# EAGLE design Fuel Sensor (EAGLE 7.5.0)
CNAME: MySensors Fuel Gauge; CREVISION: 1.0; DESIGNER: Diving91
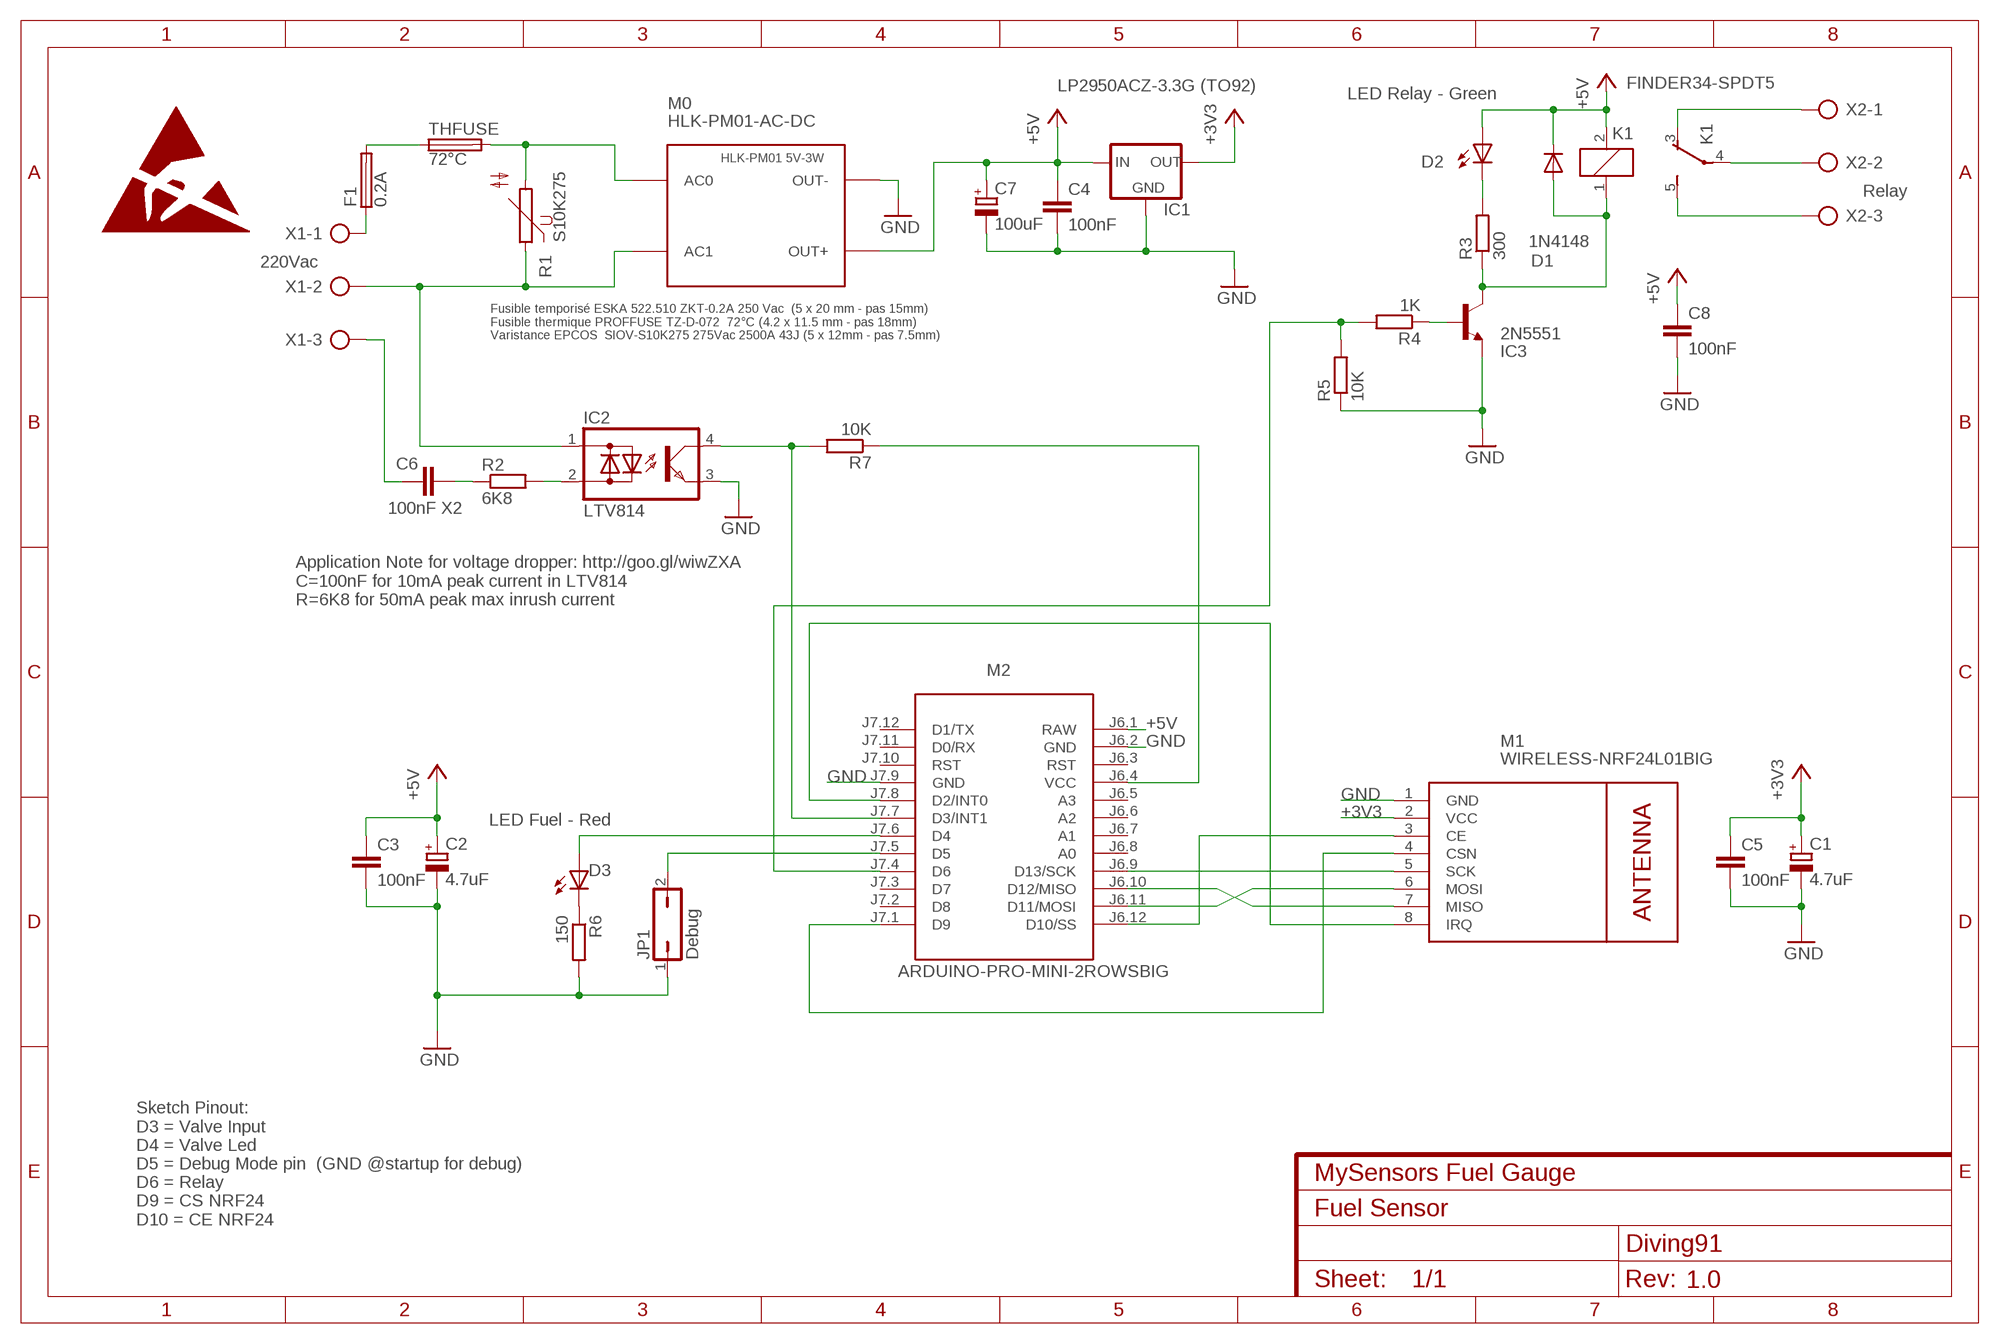
[diagram p0: schematic, sheet 1]

## Parts
C1  4.7uF  CPOL-RADE2-5  [E2-5]
C2  4.7uF  CPOL-RADE2-5  [E2-5]
C3  100nF  CNP-RADC320  [C-C320]
C4  100nF  CNP-RADC320  [C-C320]
C5  100nF  CNP-RADC320  [C-C320]
C6  100nF X2  CNP-RADB32922  [C-B32922-MKPX2]
C7  100uF  CPOL-RADE3-8  [E3-8]
C8  100nF  CNP-RADC320  [C-C320]
D1  1N4148  1N4148DO35  [DO35]
D2  LED Relay - Green  LED5MM  [LED5MM]
D3  LED Fuel - Red  LED5MM  [LED5MM]
F1  0.2A  PTF75  [PTF75]
IC1  LP2950ACZ-3.3G (TO92)  78LXXTO92L  [DC-DC-TO92L]
IC2  LTV814  [DIL04]
IC3  2N5551  T-NPNT092L  [T-T092L]
JP1  Debug  JUMPER2  [JUMPER2]
K1  FINDER34-SPDT5  [FINDER34-SPDT]
M0  HLK-PM01-AC-DC  [HLK-PM01-AC-DC]
M1  WIRELESS-NRF24L01BIG  [WIRELESS-NRF24L01-DIY]
M2  ARDUINO-PRO-MINI-2ROWSBIG  [ARDUINO-PRO-MINI-2ROWS-DIY]
R1  S10K275  [S10K275]
R2  6K8  RPMR02S  [PMR02S]
R3  300  RPMR0.25W  [PMR0.25W]
R4  1K  RPMR0.25W  [PMR0.25W]
R5  10K  RPMR0.25W  [PMR0.25W]
R6  150  RPMR0.25W  [PMR0.25W]
R7  10K  RPMR0.25W  [PMR0.25W]
THFUSE  72°C  PROFFUSE-TZ-D  [PROFFUSE-TZ-D]
X1  220Vac  DG301-5.0-3  [DG301-5.0-3]
X2  Relay  DG301-5.0-3  [DG301-5.0-3]

## Nets
+3V3 [VCC]: C1.+ C5.1 IC1.OUT M1.2(VCC)
+5V [VCC]: C2.+ C3.1 C4.1 C7.+ C8.1 D1.C D2.A IC1.IN K1.2 M0.OUT+ M2.J6.1(RAW)
GND [VCC]: C1.- C2.- C3.2 C4.2 C5.2 C7.- C8.2 IC1.GND IC2.3(E) IC3.E JP1.1 M0.OUT- M1.1(GND) M2.J6.2(GND) M2.J7.9(GND) R5.1 R6.2
LINE [AC]: F1.1 X1.1
LINE1 [AC]: F1.2 THFUSE.1
N$1: D2.K(C) R3.2
N$2: M1.8(IRQ) M2.J7.8(D2/INT0)
N$3: D1.A IC3.C K1.1 R3.1
N$4 [AC]: M0.AC0 R1.2 THFUSE.2
N$5: M1.7(MISO) M2.J6.10(D12/MISO)
N$6: M1.6(MOSI) M2.J6.11(D11/MOSI)
N$7: M1.4(CSN) M2.J7.1(D9)
N$8: M1.5(SCK) M2.J6.9(D13/SCK)
N$9: M1.3(CE) M2.J6.12(D10/SS)
N$10: JP1.2 M2.J7.5(D5)
N$11: D3.A M2.J7.6(D4)
N$12: M2.J7.4(D6) R4.2 R5.2
N$13: IC2.4(C) M2.J7.7(D3/INT1) R7.2
N$14: M2.J6.4(VCC) R7.1
N$16: D3.K(C) R6.1
N$17 [AC]: C6.2 R2.1
N$18 [AC]: IC2.2(AC2) R2.2
N$20: IC3.B R4.1
NEUTRAL [AC]: IC2.1(AC1) M0.AC1 R1.1 X1.2
RC: K1.4(-1:P) X2.2
ROFF: K1.3(-1:O) X2.1
RON: K1.5(-1:S) X2.3
VALVE [AC]: C6.1 X1.3
Unconnected: M2.J6.3(RST) M2.J6.5(A3) M2.J6.6(A2) M2.J6.7(A1) M2.J6.8(A0) M2.J7.2(D8) M2.J7.3(D7) M2.J7.10(RST) M2.J7.11(D0/RX) M2.J7.12(D1/TX)

## Notes on the sheet
- Fusible temporisé ESKA 522.510 ZKT-0.2A 250 Vac  (5 x 20 mm - pas 15mm)
  Fusible thermique PROFFUSE TZ-D-072  72°C (4.2 x 11.5 mm - pas 18mm)
  Varistance EPCOS  SIOV-S10K275 275Vac 2500A 43J (5 x 12mm - pas 7.5mm)
- Application Note for voltage dropper: http://goo.gl/wiwZXA
  C=100nF for 10mA peak current in LTV814
  R=6K8 for 50mA peak max inrush current
- Sketch Pinout:
  D3 = Valve Input
  D4 = Valve Led
  D5 = Debug Mode pin  (GND @startup for debug)
  D6 = Relay
  D9 = CS NRF24
  D10 = CE NRF24

## Library data of the parts
C1 C2 C7 = diving91:CPOL-RAD: POLARIZED CAPACITOR, European symbol
C3-C6 C8 = diving91:CNP-RAD: CAPACITOR naming: grid - package width
D1 = diving91:1N4148: DIODE high speed (Philips)
D2 D3 = diving91:LED5MM
F1 = diving91:PTF75: FUSE HOLDER grid 15mm Stelvio Kontex PTF75
IC1 = diving91:78LXX: VOLTAGE REGULATOR
IC2 = diving91:LTV814: Liteon OPTO COUPLER
IC3 = diving91:T-NPN
JP1 = diving91:JUMPER2: JUMPER
K1 = diving91:FINDER34-SPDT: Finder Serie 34 SPDT Relai
M0 = diving91:HLK-PM01-AC-DC: HLK-PM01 AC-DC 110-220VAC to 5V Mini Power Supply Module http://www.hlktech.net/product_detail.php?ProId=54
M1 = diving91:WIRELESS-NRF24L01: 2.4 GHz Wireless Module based on NRF24L01 chip
M2 = diving91:ARDUINO-PRO-MINI-2ROWS: Arduino Pro Mini deek-Robot Only 2 main rows
R1 = diving91:S10K275: VARISTOR
R2-R7 = diving91:R: RESISTOR, European symbol
THFUSE = diving91:PROFFUSE-TZ-D: PROFFUSE TZ-D
X1 X2 = diving91:DG301-5.0-3: CONNECTOR Degson DG301 5.0mm

## Net classes
0 default: width 0.635 mm, clearance 0.635 mm
1 AC: width 1.778 mm, clearance 1.778 mm
2 VCC: width 1.27 mm, clearance 0.762 mm

## Board
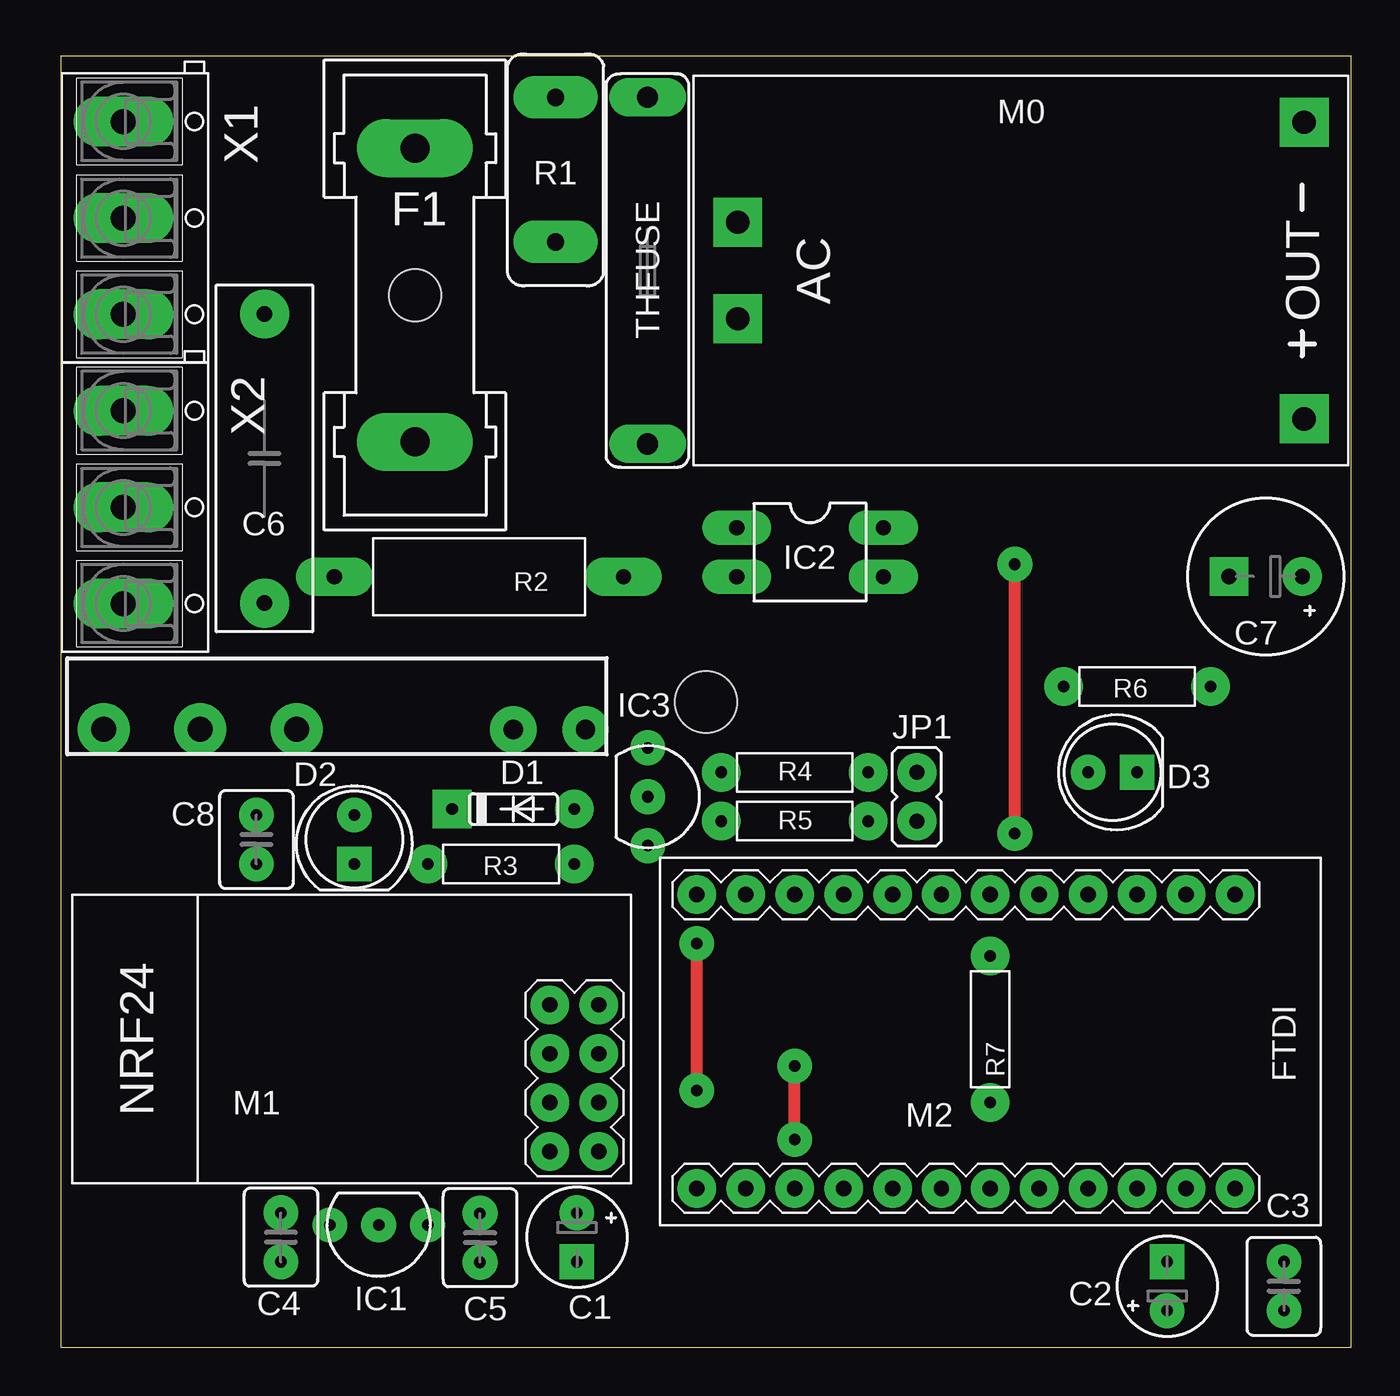
[diagram p1: board, top side]
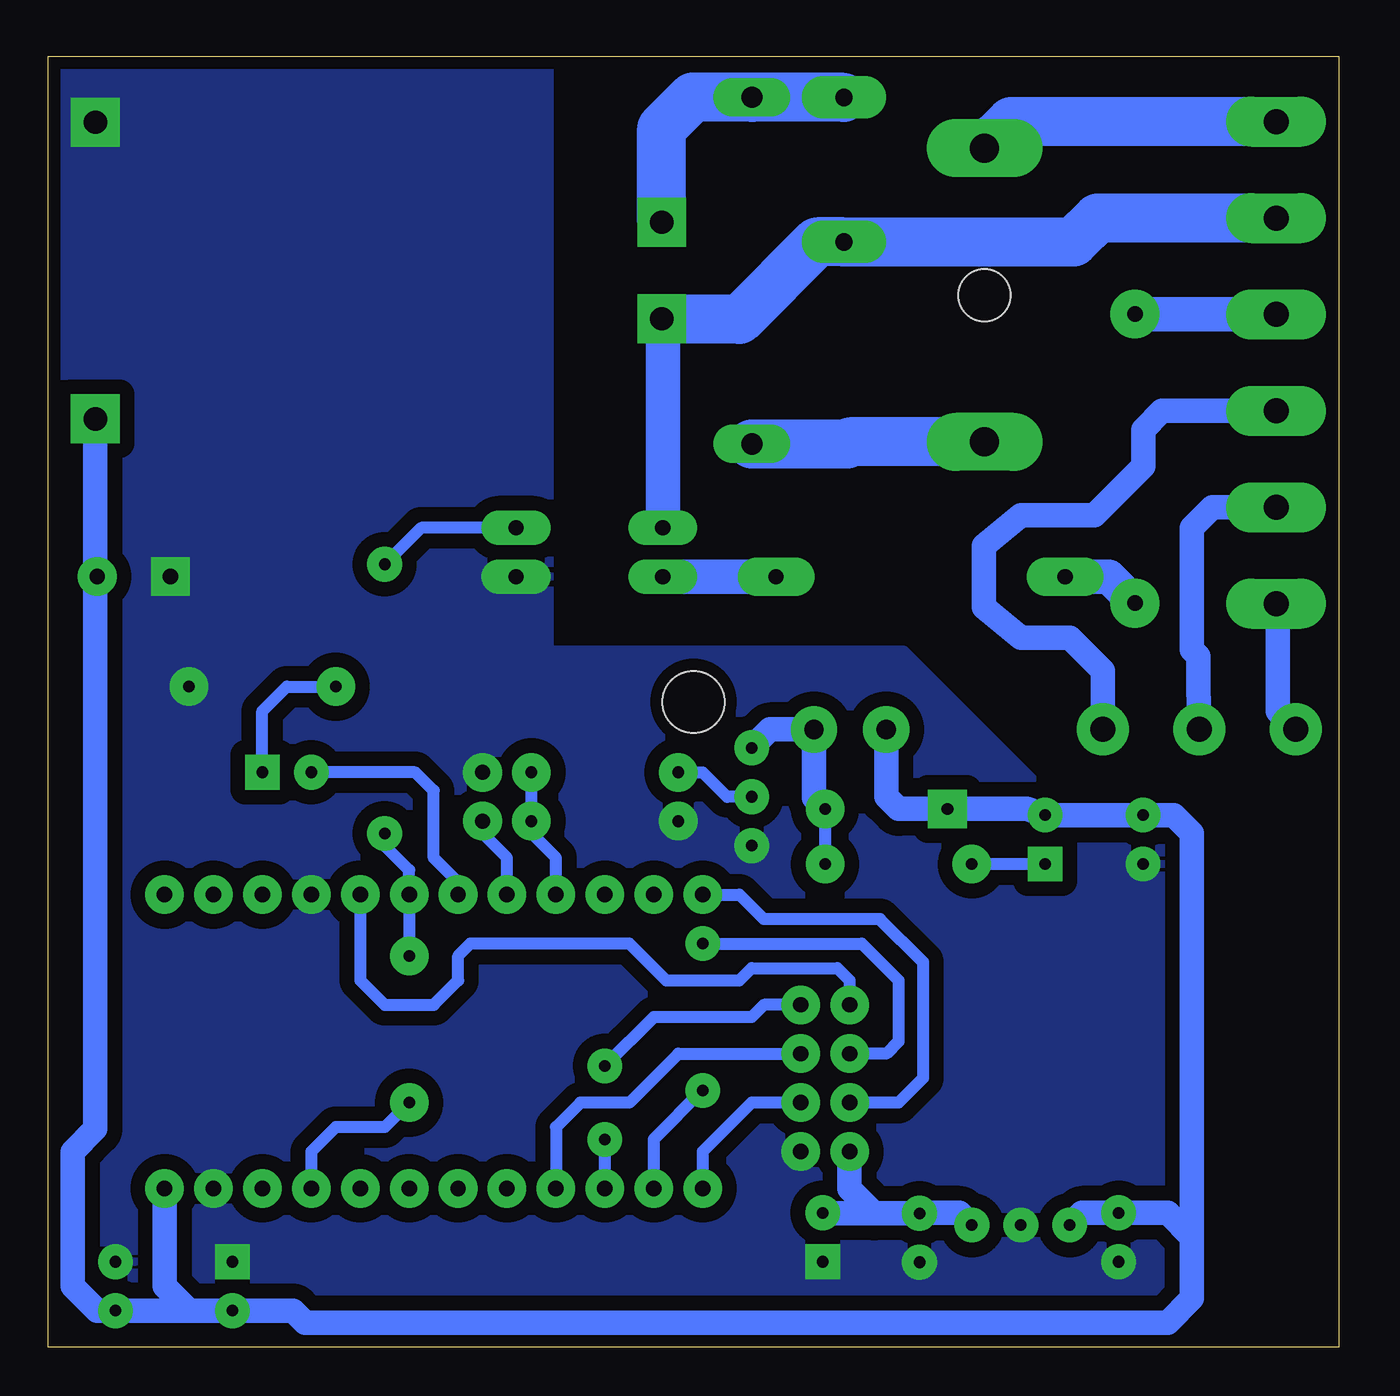
[diagram p2: board, bottom side, seen from below]

Size 67 x 67 mm. Coordinates in mm from the lower left corner, seen from the top.
Outline: 0,0 67,0 67,67 0,67 0,0
Copper layers (1*16): Top 0.035mm / dielectric 1.5mm / Bottom 0.035mm
Design rules "DIY *": minimum track width 0.6mm, minimum drill 0.6mm, track to track 0.6mm, track to pad 0.6mm, pad to pad 0.6mm, via to via 0.6mm, smd to smd 0mil, copper to edge 25mil, drill to drill 0.6mm, minimum pad ring 10mil, minimum via ring 6mil, stop-mask expansion 2mil, vias tented up to drill 100mil, thermal gap 0mil
Holes 3.2 mm at 33.5,33.5

### Footprints (pad centres in the part's own frame; a part is rotated, then mirrored left to right if it is on the bottom)
E2-5 = drill 0.6 pad 1.8: + -1.27,0 | drill 0.6 pad 1.8 square: - 1.27,0
C-C320 = drill 0.6 pad 1.8: 1 -1.27,0; 2 1.27,0
C-B32922-MKPX2 = drill 0.8 pad 2.54: 1 -7.5,0; 2 7.5,0
E3-8 = drill 0.8 pad 2: + -1.905,0 | drill 0.8 pad 2 square: - 1.905,0
DO35 = drill 0.6 pad 2: A 3.175,0 | drill 0.6 pad 2 square: C -3.175,0
LED5MM = drill 0.6 pad 1.8: A -1.27,0 | drill 0.6 pad 1.8 square: K 1.27,0
PTF75 = drill 1.5 pad 3 long: 1 -7.62,0; 2 7.62,0 | hole 2.7: 0,0
DC-DC-TO92L = drill 0.6 pad 1.8: GND 0,0; IN 2.54,0; OUT -2.54,0
DIL04 = drill 0.8 pad 1.8 long: 1 -1.27,-3.81; 2 1.27,-3.81; 3 1.27,3.81; 4 -1.27,3.81
T-T092L = drill 0.6 pad 1.8: B 0,0; C -2.54,0; E 2.54,0
JUMPER2 = drill 0.8 pad 2: 1 0,-1.27; 2 0,1.27
FINDER34-SPDT = drill 1 pad 2.4: 1 3.75,0; 2 0,0 | drill 1.3 pad 2.7: 3 -11.25,0; 4 -16.25,0; 5 -21.25,0
HLK-PM01-AC-DC = drill 1.2 pad 2.54 square: AC0 -14.7,2.5; AC1 -14.7,-2.5; OUT+ 14.7,-7.7; OUT- 14.7,7.7
WIRELESS-NRF24L01-DIY = drill 0.8 pad 2: 1 -12.7,6.35; 2 -10.16,6.35; 3 -12.7,3.81; 4 -10.16,3.81; 5 -12.7,1.27; 6 -10.16,1.27; 7 -12.7,-1.27; 8 -10.16,-1.27
ARDUINO-PRO-MINI-2ROWS-DIY = drill 0.8 pad 2: J6.1 -12.7,7.62; J6.2 -10.16,7.62; J6.3 -7.62,7.62; J6.4 -5.08,7.62; J6.5 -2.54,7.62; J6.6 0,7.62; J6.7 2.54,7.62; J6.8 5.08,7.62; J6.9 7.62,7.62; J6.10 10.16,7.62; J6.11 12.7,7.62; J6.12 15.24,7.62; J7.1 15.24,-7.62; J7.2 12.7,-7.62; J7.3 10.16,-7.62; J7.4 7.62,-7.62; J7.5 5.08,-7.62; J7.6 2.54,-7.62; J7.7 0,-7.62; J7.8 -2.54,-7.62; J7.9 -5.08,-7.62; J7.10 -7.62,-7.62; J7.11 -10.16,-7.62; J7.12 -12.7,-7.62
S10K275 = drill 0.9 pad 2.2 long: 1 0,-3.75; 2 0,3.75
PMR02S = drill 0.8 pad 2 long: 1 -7.5,0; 2 7.5,0
PMR0.25W = drill 0.6 pad 2: 1 0,0; 2 7.62,0
PROFFUSE-TZ-D = drill 1.1 pad 2 long: 1 -9,0; 2 9,0
DG301-5.0-3 = drill 1.3 pad 2.6 long: 1 2.5,0; 2 -2.515,0; 3 -7.5,0

### Placement (x,y rotation side)
C1  26.8,5.71 270 top
C2  57.44,3.17 90 top
C3  63.5,3.17 90 top
C4  11.43,5.71 270 top
C5  21.77,5.69 270 top
C6  10.58,46.13 270 top
C7  62.55,40.01 180 top
C8  10.16,26.35 270 top
D1  23.5,27.94 0 top
D2  LED Relay  [LED5MM]  15.24,26.35 270 top
D3  LED Fuel  [LED5MM]  54.61,29.84 0 top
DRILEGEND  [DRILEGEND]  -10.57,-4.01 0 top  (outside the outline)
F1  18.39,54.61 270 top
IC1  16.51,6.35 180 top
IC2  38.9,41.26 270 top
IC3  30.48,28.57 270 top
JP1  44.45,28.57 180 top
K1  23.5,32.07 0 top
M0  49.85,55.88 0 top
M1  15.24,16.51 180 top
M2  48.26,15.88 180 top
R1  25.69,61.11 0 top
R2  21.72,39.99 0 top
R3  1K  [PMR0.25W]  26.67,25.08 180 top
R4  34.29,29.84 0 top
R5  34.29,27.3 0 top
R6  1K  [PMR0.25W]  52.07,34.29 0 top
R7  48.26,12.7 90 top
THFUSE  30.47,55.88 90 top
X1  3.25,61.11 90 top
X2  3.25,46.1 90 top

### Tracks (layer width: path | path; a pad name or v marks a point on that pad's centre or on a via)
+3V3
  Bottom 1.27: IC1.OUT 19.68,6.99 21.74,6.99 C5.1 24.13,6.96 | 24.13,6.96 26.77,6.96 C1.+ | M1.2 25.4,8.23 24.13,6.96
+5V
  Bottom 1.27: 7.62,5.71 7.62,2.54 8.89,1.27 53.66,1.27 54.29,1.91 C2.+ 59.69,1.91 | 7.62,5.71 8.89,6.99 C4.1 13.34,6.99 IC1.IN | 59.69,1.91 C3.1 64.45,1.91 65.72,3.17 65.72,10.16 64.55,11.34 64.55,39.37 | M2.J6.1 60.96,3.17 59.69,1.91 | M0.OUT+ 64.55,39.37 | C7.+ 64.45,39.47 64.55,39.37 | K1.2 23.5,28.57 22.86,27.94 D1.C 16.19,27.94 D2.A C8.1 8.57,27.62 7.62,26.67 7.62,5.71
GND
  pour Bottom: 40.96,66.99 66.99,66.99 66.99,0 0,0 0,8.57 6.99,8.57 6.99,23.5 0,23.5 0,29.21 15.56,29.21 22.54,36.2 40.96,36.2
LINE
  Bottom 2.54: X1.1 17.01,63.61 F1.1
LINE1
  Bottom 2.54: F1.2 25.4,46.99 25.51,46.88 THFUSE.1
N$1
  Bottom 0.635: D2.K R3.2
N$2
  Bottom 0.635: M2.J7.8 50.8,19.05 49.53,17.78 46.99,17.78 45.72,19.05 45.72,20.32 45.09,20.95 36.83,20.95 34.92,19.05 31.11,19.05 30.48,19.68 26.04,19.68 25.4,19.05 M1.8
N$3
  Bottom 0.635: D1.A R3.1
  Bottom 1.27: IC3.C 29.53,32.07 K1.1 27.25,28.52 D1.A
N$4
  Bottom 2.54: R1.2 30.45,64.86 THFUSE.2 33.55,64.88 35.15,63.28 M0.AC0
N$5  (via drill 0.6 pad 1.8)
  Top 0.635: v38.1,10.79 v38.1,14.61
  Bottom 0.635: M2.J6.10 v38.1,10.79 | M1.7 29.84,17.78 30.48,17.14 35.56,17.14 v38.1,14.61
N$6  (via drill 0.6 pad 1.8)
  Top 0.635: v33.02,13.34 v33.02,20.95
  Bottom 0.635: v33.02,20.95 24.77,20.95 22.86,19.05 22.86,15.88 23.5,15.24 M1.6 | M2.J6.11 35.56,10.79 v33.02,13.34
N$7
  Bottom 0.635: M2.J7.1 31.11,23.5 29.84,22.23 23.81,22.23 21.59,20 21.59,13.97 22.86,12.7 M1.4
N$8
  Bottom 0.635: M2.J6.9 40.64,11.43 39.37,12.7 36.83,12.7 34.29,15.24 M1.5
N$9
  Bottom 0.635: M1.3 30.48,12.7 33.02,10.16 M2.J6.12
N$10
  Bottom 0.635: M2.J7.5 43.18,25.4 44.45,26.67 JP1.2
N$11
  Bottom 0.635: D3.A 47.94,29.84 46.99,28.89 46.99,25.4 45.72,24.13 M2.J7.6
N$12
  Bottom 0.635: R4.2 R5.2 41.91,26.67 40.64,25.4 M2.J7.4
N$13  (via drill 0.6 pad 1.8)
  Top 0.635: v49.53,26.67 v49.53,40.64
  Bottom 0.635: R7.2 M2.J7.7 48.26,24.77 49.53,26.04 v49.53,26.67 | IC2.4 47.64,42.53 v49.53,40.64
N$14
  Bottom 0.635: R7.1 49.53,11.43 52.07,11.43 53.34,10.16 M2.J6.4
N$16
  Bottom 0.635: D3.K 55.88,33.02 54.61,34.29 R6.1
N$17
  Bottom 1.778: R2.1 11.95,39.99 C6.2
N$18
  Bottom 1.778: IC2.2 R2.2
N$20
  Bottom 0.635: IC3.B 31.75,28.57 33.02,29.84 R4.1
NEUTRAL
  Bottom 1.778: M0.AC1 35.09,53.32 IC2.1
  Bottom 2.54: X1.2 12.52,58.6 13.76,57.36 R1.1 27.09,57.36 31.11,53.34 31.16,53.38 M0.AC1
RC
  Bottom 1.27: X2.2 6.58,43.59 7.62,42.55 7.62,36.2 7.3,35.88 7.3,34.35 K1.4
ROFF
  Bottom 1.27: X2.1 9.18,48.6 10.16,47.62 10.16,45.72 12.7,43.18 16.51,43.18 18.41,41.59 18.41,38.42 16.51,36.83 13.97,36.83 12.24,35.1 K1.3
RON
  Bottom 1.27: K1.5 2.25,32.09 3.17,33.02 3.17,38.52 X2.3
VALVE
  Bottom 1.778: X1.3 10.56,53.61 C6.1

### Text on the board
DrillLegend: LAYER-STACK
DrillLegend_01-16: 01-16
DrillLegend_01-20: 01-20